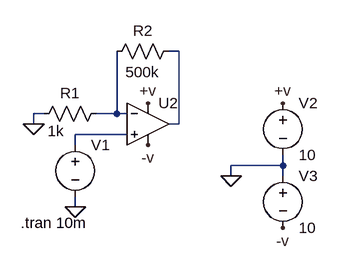
[diagram p0: schematic opamp.asc]
opamp.asc, the LTspice schematic file:
Version 4
SHEET 1 880 680
WIRE 240 64 224 64
WIRE 32 160 16 160
WIRE 144 160 144 64
WIRE 144 160 112 160
WIRE 160 160 144 160
WIRE 16 176 16 160
WIRE 240 176 240 64
WIRE 240 176 224 176
WIRE 160 192 80 192
WIRE 80 208 80 192
WIRE 400 240 400 224
WIRE 400 240 320 240
WIRE 320 256 320 240
WIRE 400 256 400 240
WIRE 80 304 80 288
FLAG 16 176 0
FLAG 80 304 0
FLAG 320 256 0
FLAG 400 144 +v
FLAG 400 336 -v
FLAG 192 144 +v
FLAG 192 208 -v
SYMBOL res 128 144 R90
WINDOW 0 0 56 VBottom 2
WINDOW 3 27 78 VTop 2
SYMATTR InstName R1
SYMATTR Value 1k
SYMBOL res 240 48 R90
WINDOW 0 0 56 VBottom 2
WINDOW 3 32 56 VTop 2
SYMATTR InstName R2
SYMATTR Value 500k
SYMBOL voltage 80 192 R0
WINDOW 3 24 96 Invisible 2
WINDOW 123 0 0 Left 2
WINDOW 39 0 0 Left 2
SYMATTR InstName V1
SYMATTR Value SINE(0 10m 1k 1n)
SYMBOL Opamps\\UniversalOpamp2 192 176 R0
SYMATTR InstName U2
SYMBOL voltage 400 128 R0
WINDOW 123 0 0 Left 2
WINDOW 39 0 0 Left 2
SYMATTR InstName V2
SYMATTR Value 10
SYMBOL voltage 400 240 R0
WINDOW 123 0 0 Left 2
WINDOW 39 0 0 Left 2
SYMATTR InstName V3
SYMATTR Value 10
TEXT -4 328 Left 2 !.tran 10m

The netlist it stands for:
* opamp.asc
R1 N002 0 1k
R2 N001 N002 500k
V1 N003 0 SINE(0 10m 1k 1n)
XU2 N003 N002 +v -v N001 level.2 Avol=1Meg GBW=10Meg Slew=10Meg ilimit=25m rail=0 Vos=0 phimargin=45 en=0 enk=0 in=0 ink=0 Rin=500Meg  ; pins IN+ IN- V+ V- OUT
V2 +v 0 10
V3 0 -v 10
.tran 10m
.lib UniversalOpamps2.sub
.backanno
.end